# EAGLE design Schematics_MedidorDeTensionAC (EAGLE 9.0.0)
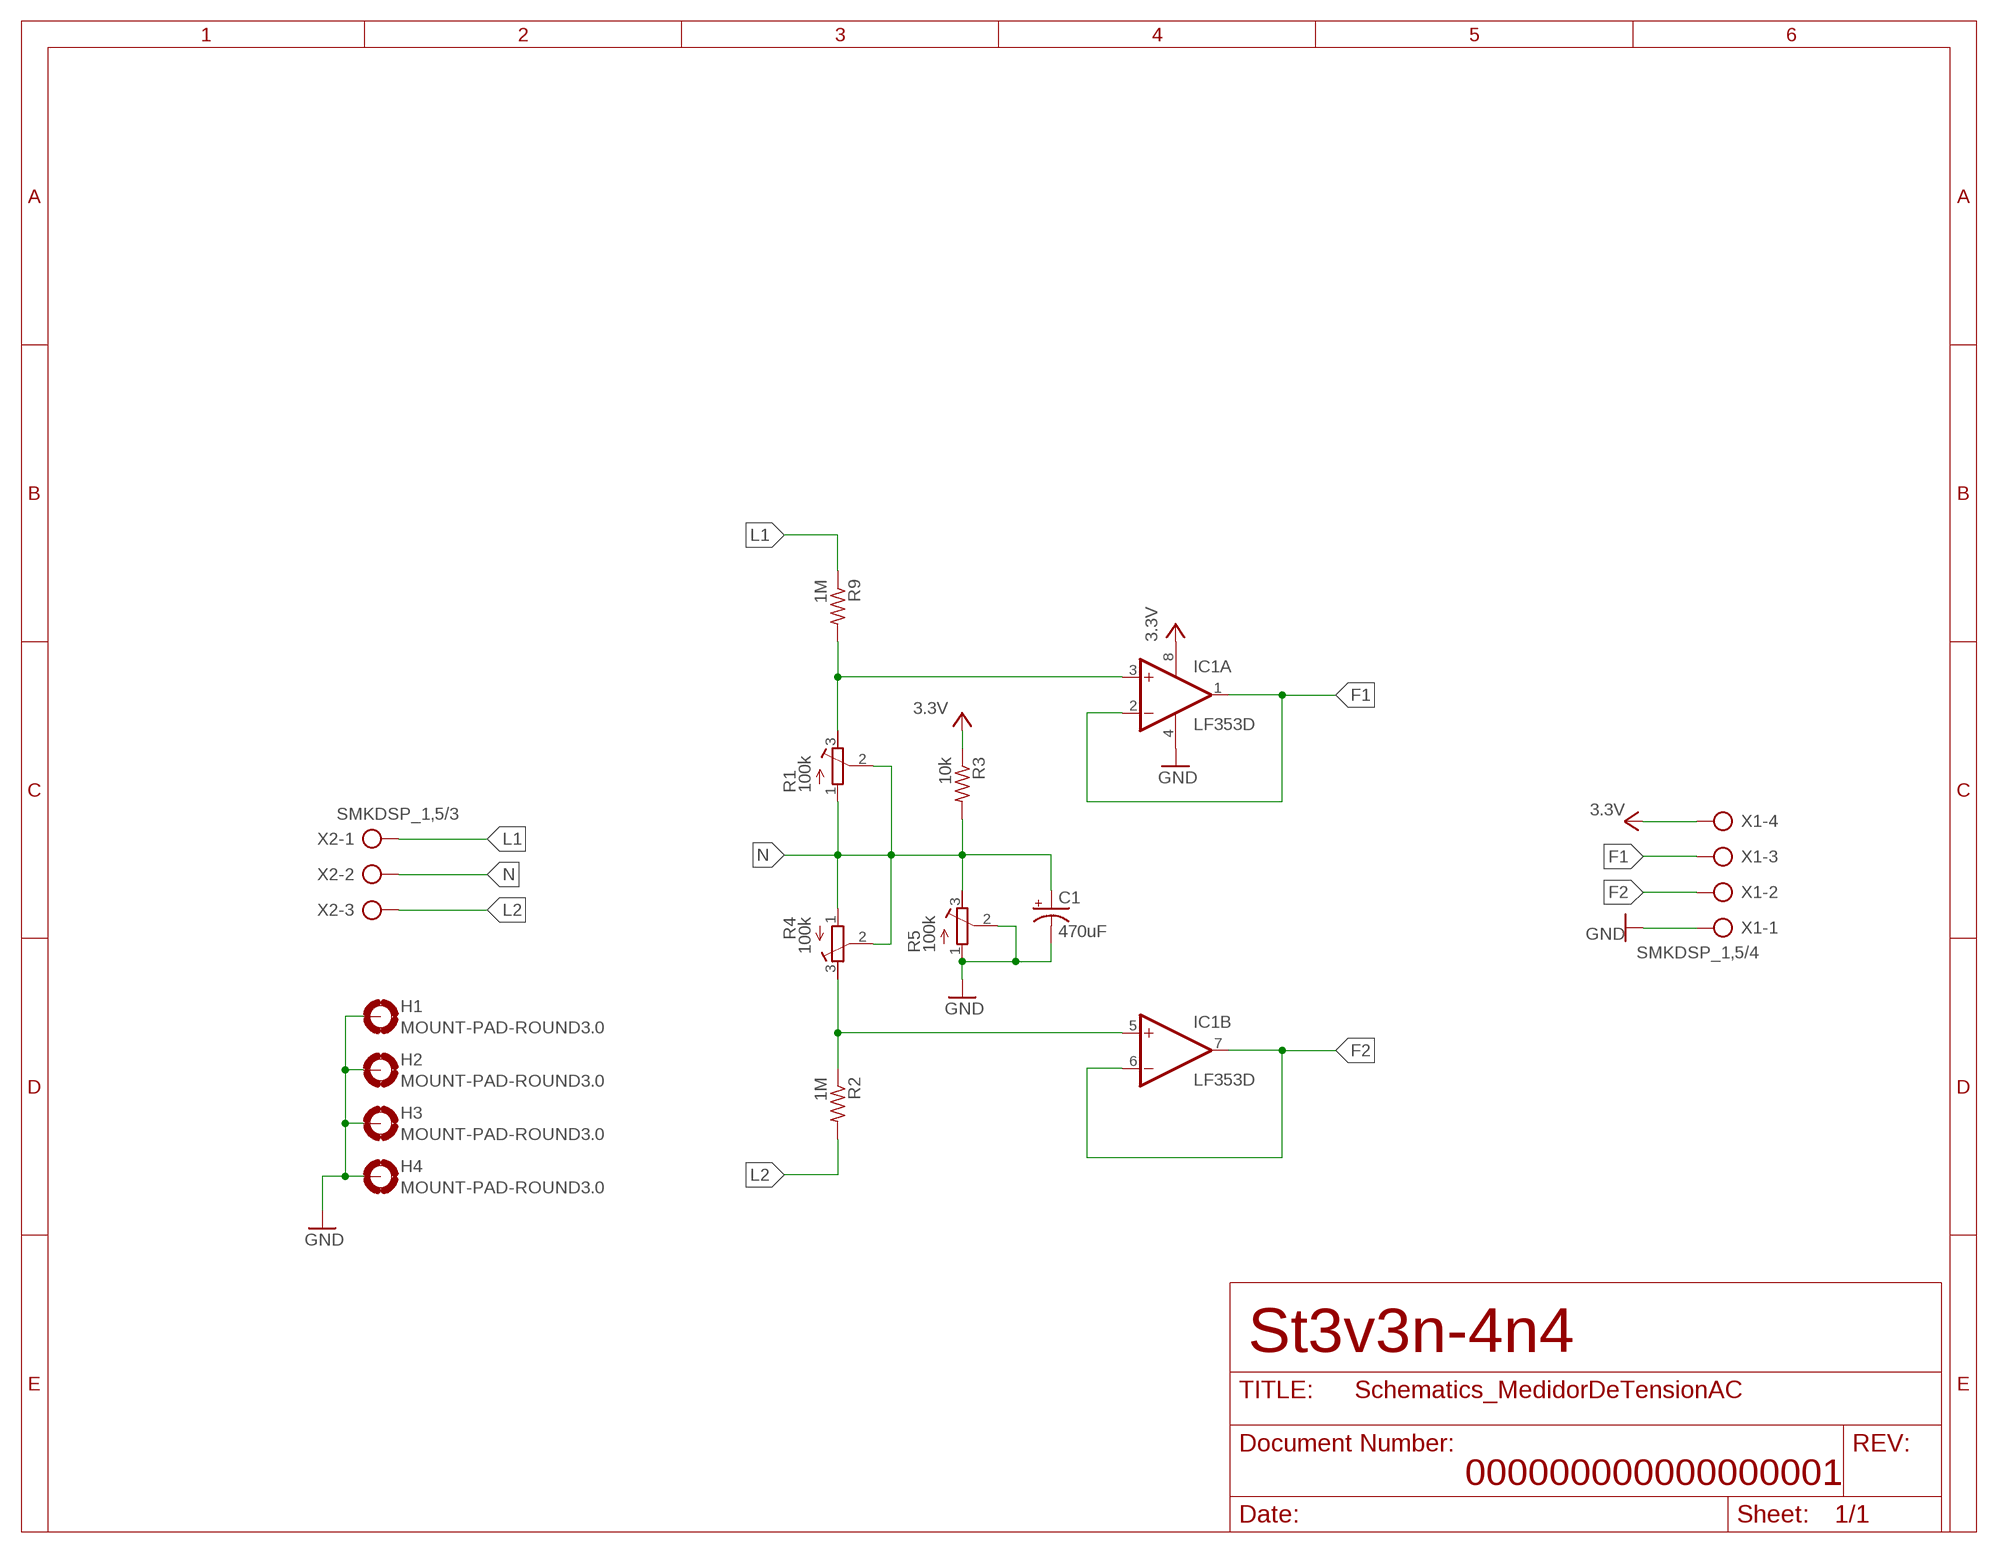
[diagram p0: schematic, sheet 1]

## Parts
C1  470uF  CPOL-USE3.5-8  [E3,5-8]
H1  MOUNT-PAD-ROUND3.0  [3,0-PAD]
H2  MOUNT-PAD-ROUND3.0  [3,0-PAD]
H3  MOUNT-PAD-ROUND3.0  [3,0-PAD]
H4  MOUNT-PAD-ROUND3.0  [3,0-PAD]
IC1  LF353D  [SO08]
R1  100k  R-TRIMM64W  [RTRIM64W]
R2  1M  R-US_0207/10  [0207/10]
R3  10k  R-US_0207/10  [0207/10]
R4  100k  R-TRIMM64W  [RTRIM64W]
R5  100k  R-TRIMM64W  [RTRIM64W]
R9  1M  R-US_0207/10  [0207/10]
X1  SMKDSP_1,5/4  [SMKDSP_1,5/4]
X2  SMKDSP_1,5/3  [SMKDSP_1,5/3]

## Nets
F1: IC1.1(A:OUT) IC1.2(A:-IN) X1.3
F2: IC1.6(B:-IN) IC1.7(B:OUT) X1.2
GND: C1.- H1.B3,0(MOUNT) H2.B3,0(MOUNT) H3.B3,0(MOUNT) H4.B3,0(MOUNT) IC1.4(P:V-) R5.1(A) R5.2(S) X1.1
IN1+: IC1.3(A:+IN) R1.3(E) R9.2
L1: R9.1 X2.1
L2: R2.2 X2.3
N: C1.+ R1.1(A) R1.2(S) R3.2 R4.1(A) R4.2(S) R5.3(E) X2.2
N$5: IC1.5(B:+IN) R2.1 R4.3(E)
VCC: IC1.8(P:V+) R3.1 X1.4 ; supply symbol labelled 3.3V

## Notes on the sheet
- St3v3n-4n4
- 000000000000000001

## Library data of the parts
C1 = rcl:CPOL-US: POLARIZED CAPACITOR, American symbol; SPICEPREFIX: C
H1-H4 = holes:MOUNT-PAD-ROUND: MOUNTING PAD, round
IC1 = linear:LF353: OP AMP; SPICEPREFIX: J
R1 R4 R5 = rcl:R-TRIMM: Trimm resistor; SPICEMODEL: X; SPICEPREFIXL: POT
R2 R3 R9 = rcl:R-US_: RESISTOR, American symbol; SPICEPREFIX: R
X1 = con-phoenix-smkdsp:SMKDSP_1,5/4: Printklemme, Nennstrom: 17,5 A, Bemessungsspannung: 250 V, Raster: 5,0 mm Source: http://eshop.phoenixcontact.de .. 1733415.pdf; MF: FARNELL; MPN: 1733596; OC_FARNELL: 3041268; OC_NEWARK: 71C4131
X2 = con-phoenix-smkdsp:SMKDSP_1,5/3: Printklemme, Nennstrom: 17,5 A, Bemessungsspannung: 250 V, Raster: 5,0 mm Source: http://eshop.phoenixcontact.de .. 1733415.pdf; MF: FARNELL; MPN: 1733583; OC_FARNELL: 3041256; OC_NEWARK: 71C4130

## Board
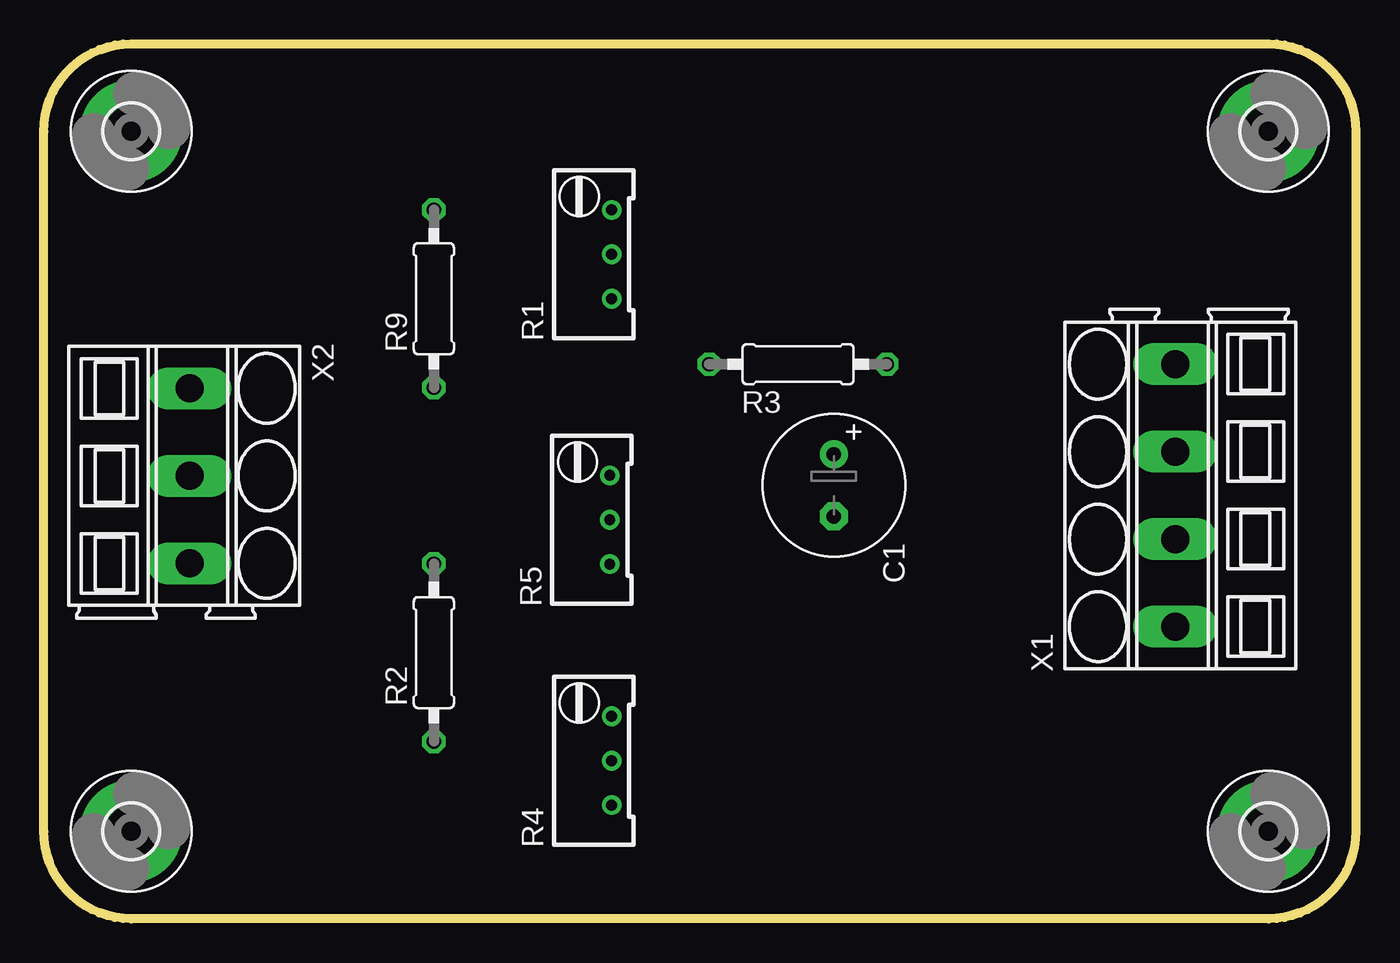
[diagram p1: board, top side]
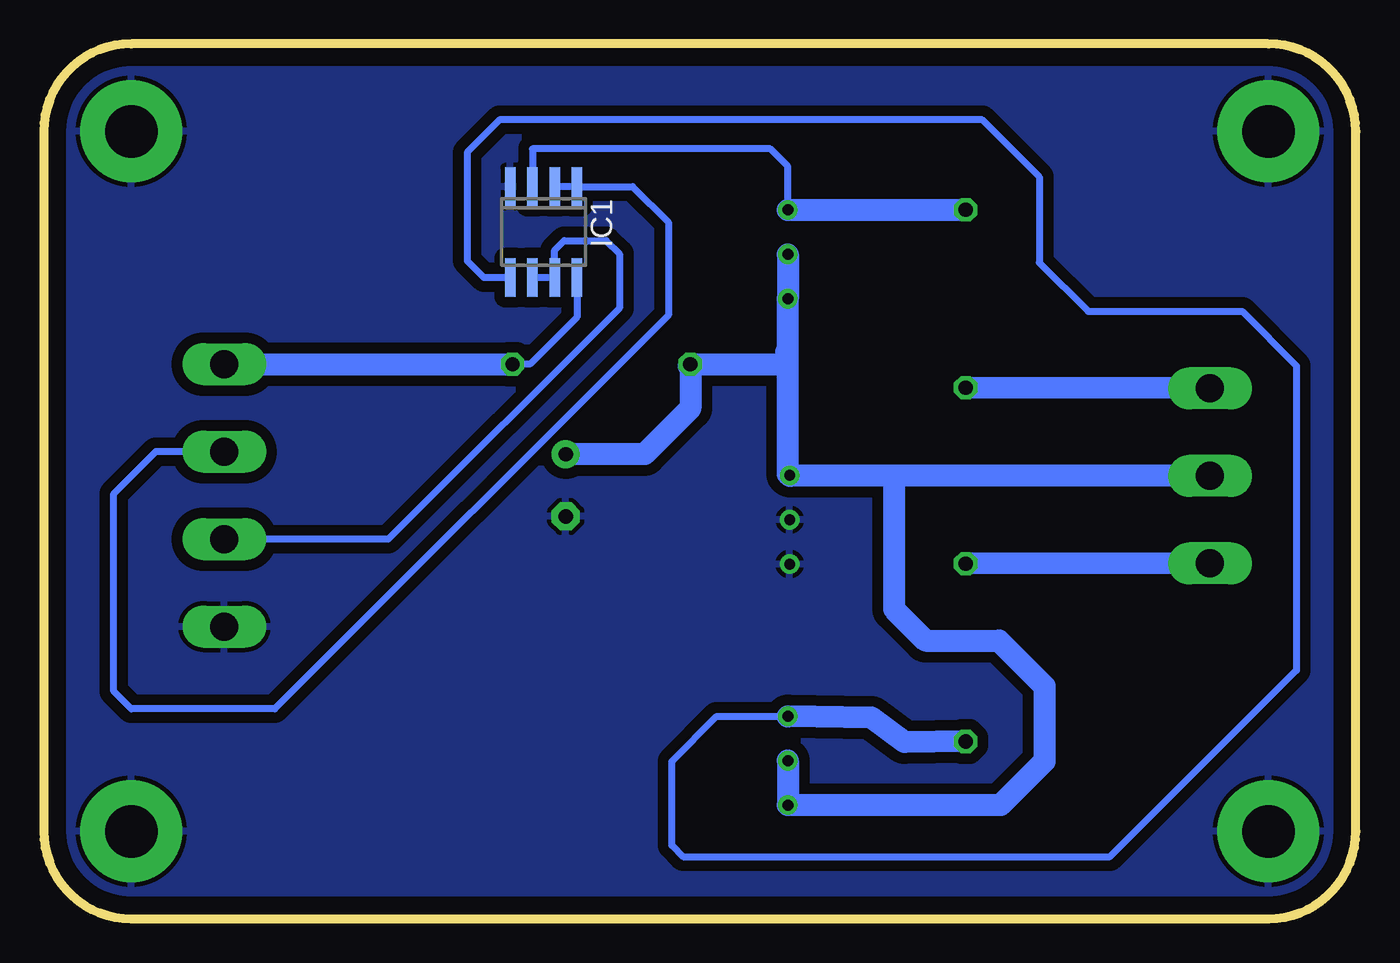
[diagram p2: board, bottom side, seen from below]

Size 75 x 50 mm. Coordinates in mm from the lower left corner, seen from the top.
Outline: 5,50 70,50 arc-90 75,45 75,5 arc-90 70,0 5,0 arc-90 0,5 0,45 arc-90 5,50
Copper layers (1*16): Top 0.035mm / dielectric 1.5mm / Bottom 0.035mm
Design rules "default": minimum track width 6mil, minimum drill 0.35mm, track to track 6mil, track to pad 6mil, pad to pad 6mil, via to via 6mil, smd to smd 6mil, copper to edge 40mil, drill to drill 6mil, minimum pad ring 10mil, minimum via ring 8mil, stop-mask expansion 4mil, vias tented up to drill 0mil, thermal gap 10mil

### Footprints (pad centres in the part's own frame; a part is rotated, then mirrored left to right if it is on the bottom)
E3,5-8 = drill 0.813 pad 1.6: + -1.778,0 | drill 0.813 pad 1.6 octagon: - 1.778,0
3,0-PAD = drill 3 pad 5.842: B3,0 0,0
SO08 = smd 0.6 x 2.2: 1 -1.905,-2.6; 2 -0.635,-2.6; 3 0.635,-2.6; 4 1.905,-2.6; 5 1.905,2.6; 6 0.635,2.6; 7 -0.635,2.6; 8 -1.905,2.6
RTRIM64W = drill 0.61: 1 1.27,-2.54; 2 1.27,0; 3 1.27,2.54
0207/10 = drill 0.813 octagon: 1 -5.08,0; 2 5.08,0
SMKDSP_1,5/4 = drill 1.6 pad 1.8 long: 1 -2.5,0; 2 2.5,0; 3 7.5,0; 4 12.5,0
SMKDSP_1,5/3 = drill 1.6 pad 1.8 long: 1 -2.5,0; 2 2.5,0; 3 7.5,0

### Placement (x,y rotation side)
C1  45.16,24.77 270 top
H1  70,5 0 top
H2  70,45 0 top
H3  5,45 0 top
H4  5,5 0 top
IC1  46.43,39.24 180 bottom
R1  31.19,37.97 0 top
R2  22.3,15.21 90 top
R3  43.12,31.69 180 top
R4  31.19,9.03 0 top
R5  31.09,22.8 0 top
R9  22.3,35.43 90 top
X1  64.68,19.19 90 top
X2  8.33,27.81 270 top

### Tracks (layer width: path | path; a pad name or v marks a point on that pad's centre or on a via)
F1
  Bottom 0.406: IC1.1 IC1.2 | 66.79,26.69 X1.3 68.59,26.69 68.6,26.7 71,24.3 71,13 70,12 61.8,12 39.3,34.5 39.3,39.8 41.34,41.84 IC1.1 | 44.5,41.87 IC1.1
F2
  Bottom 0.406: IC1.6 IC1.7 45.8,38.2 45.25,38.75 42.85,38.75 42.1,38 42.1,34.9 55.31,21.69 X1.2
GND
  Bottom 0.406: X1.1
  pour Bottom (isolate 0.61, rank 2): 0,45 0,5 arc90 5,0 6,0 70,0 arc90 75,5 75,6 75,45 arc90 70,50 69,50 5,50 arc90
IN1+
  Bottom 0.406: R1.3 32.46,43 33.46,44 47.06,44 IC1.3
  Bottom 1.27: R1.3 R9.2
L1
  Bottom 1.27: X2.1 R9.1
L2
  Bottom 1.27: X2.3 R2.2
N
  Bottom 1.27: R4.2 R4.1 20.31,6.49 17.8,9 17.8,13.3 20.4,15.9 24.6,15.9 26.4,17.7 26.4,25.31 | 32.46,31.7 32.46,25.44 arc-90 R5.3 32.33,25.31 26.4,25.31 | 32.46,31.7 32.46,32.3 | 32.46,32.3 R1.1 R1.2 | X2.2 26.4,25.31 | 32.55,32.39 32.46,32.3 | 38.13,31.6 R3.2 | R3.2 32.47,31.69 32.46,31.7 | R3.2 38.04,29.16 40.65,26.55 C1.+
N$5
  Bottom 0.406: IC1.5 49.84,36.64 50.8,37.6 50.8,43.8 48.95,45.65 21.35,45.65 18.1,42.4 18.1,37.5 15.3,34.7 6.5,34.7 3.4,31.6 3.4,14.2 14.05,3.55 38.45,3.55 39.1,4.2 39.1,9 36.53,11.57 R4.3
  Bottom 1.27: R2.1 25.8,10.1 27.7,11.5 R4.3
VCC
  Bottom 0.406: IC1.8 44.52,34.38 47.21,31.69 R3.1
  Bottom 1.27: X1.4 R3.1